# Altium schematic sheet motordriver-v5.1_demux_dribbler.SchDoc
size A4; SheetNumber: 12; SheetTotal: 12
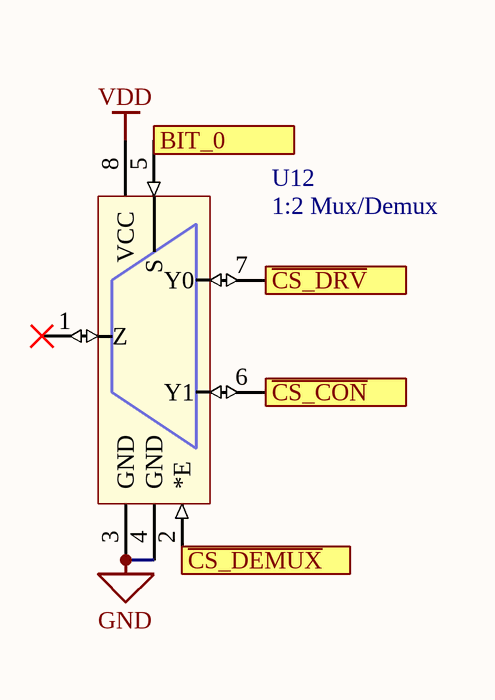
[diagram p0: motordriver-v5.1_demux_dribbler.SchDoc]

## Parts
U12  1:2 Mux/Demux  [TSOP65P400X110-8N]

## Ports
BIT_0 (in), ~{CS_CON} (out), ~{CS_DEMUX} (in), ~{CS_DRV} (out)

## Nets
GND: U12.3(GND) U12.4(GND)
VDD: U12.8(VCC)
BIT_0: U12.5(S) ; port BIT_0
~{CS_CON}: U12.6(Y1) ; port ~{CS_CON}
~{CS_DEMUX}: U12.2(*E) ; port ~{CS_DEMUX}
~{CS_DRV}: U12.7(Y0) ; port ~{CS_DRV}

Not connected (* = marked no-connect by the designer): U12 1(Z)*

## Library data of the parts
U12 = 74LVC1G53DP,125: 74LVC Series 5.5 V SMT 2-Channel Analog Multiplexer/Demultiplexer - TSSOP-8; Part Number: 74LVC1G53DP,125; Manufacturer Part Number: 74LVC1G53DP,125; Supplier 1: Digi-Key; Supplier Part Number 1: 1727-6078-1-ND; Suppler URL 1: https://www.digikey.ca/en/products/detail/nexperia-usa-inc/74LVC1G53DP-125/1300844